# EAGLE design MDBT42Q_testboard (EAGLE 8.2.2)
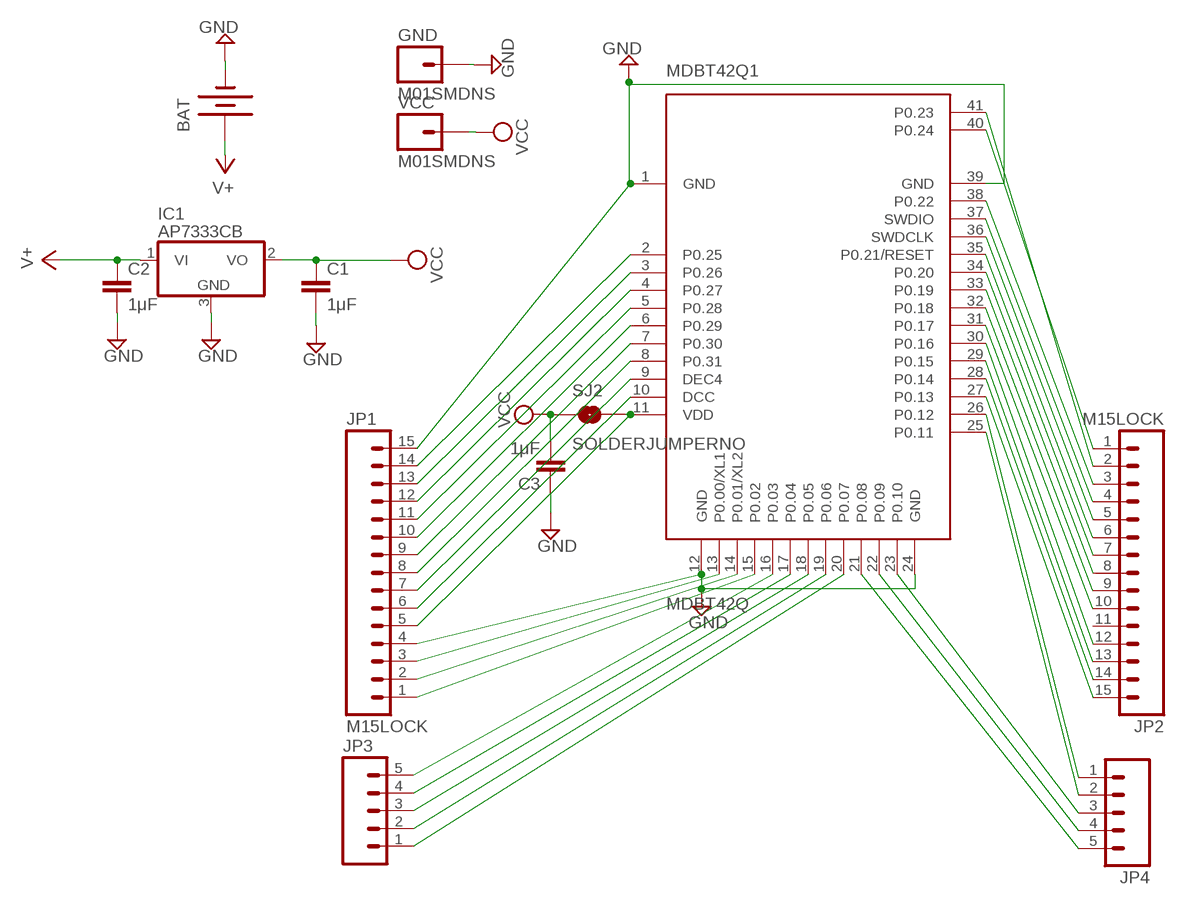
[diagram p0: schematic, sheet 1]

## Parts
BAT  BATTERYFOB  [BATTERY_20MM_PTH_COMPACT]
C1  1μF  CAP0603-CAP  [0603-CAP]
C2  1μF  CAP0603-CAP  [0603-CAP]
C3  1μF  CAP0603-CAP  [0603-CAP]
GND  M01SMDNS  [1X01NS]
IC1  AP7333CB  [SOT23]
JP1  M15LOCK  [1X15_LOCK]
JP2  M15LOCK  [1X15_LOCK]
JP3  M05LOCK  [1X05_LOCK]
JP4  M05LOCK  [1X05_LOCK]
MDBT42Q1  MDBT42Q  [MDBT42Q]
SJ2  SOLDERJUMPERNO  [SJ_2S-NO]
VCC  M01SMDNS  [1X01NS]

## Nets
GND: BAT.2(-) C1.2 C2.2 C3.1 GND.1 IC1.3(GND) JP1.4 JP1.15 MDBT42Q1.1(GND) MDBT42Q1.12(GND) MDBT42Q1.24(GND) MDBT42Q1.39(GND)
N$1: JP1.5 MDBT42Q1.11(VDD) SJ2.2
N$2: JP1.14 MDBT42Q1.2(P0.25)
N$3: JP1.13 MDBT42Q1.3(P0.26)
N$4: JP1.12 MDBT42Q1.4(P0.27)
N$5: JP1.11 MDBT42Q1.5(P0.28)
N$6: JP2.9 MDBT42Q1.32(P0.18)
N$7: JP1.10 MDBT42Q1.6(P0.29)
N$8: JP1.9 MDBT42Q1.7(P0.30)
N$9: JP1.8 MDBT42Q1.8(P0.31)
N$10: JP1.7 MDBT42Q1.9(DEC4)
N$11: JP1.6 MDBT42Q1.10(DCC)
N$12: JP1.3 MDBT42Q1.13(P0.00/XL1)
N$13: JP1.2 MDBT42Q1.14(P0.01/XL2)
N$14: JP1.1 MDBT42Q1.15(P0.02)
N$15: JP3.5 MDBT42Q1.16(P0.03)
N$16: JP3.4 MDBT42Q1.17(P0.04)
N$17: JP3.3 MDBT42Q1.18(P0.05)
N$18: JP3.2 MDBT42Q1.19(P0.06)
N$19: JP3.1 MDBT42Q1.20(P0.07)
N$20: JP4.5 MDBT42Q1.21(P0.08)
N$21: JP4.4 MDBT42Q1.22(P0.09)
N$22: JP4.3 MDBT42Q1.23(P0.10)
N$23: JP4.2 MDBT42Q1.25(P0.11)
N$24: JP4.1 MDBT42Q1.26(P0.12)
N$25: JP2.15 MDBT42Q1.27(P0.13)
N$26: JP2.14 MDBT42Q1.28(P0.14)
N$27: JP2.13 MDBT42Q1.29(P0.15)
N$28: JP2.12 MDBT42Q1.30(P0.16)
N$29: JP2.10 MDBT42Q1.31(P0.17)
N$30: JP2.8 MDBT42Q1.33(P0.19)
N$31: JP2.7 MDBT42Q1.34(P0.20)
N$32: JP2.6 MDBT42Q1.35(P0.21/RESET)
N$33: JP2.5 MDBT42Q1.36(SWDCLK)
N$34: JP2.4 MDBT42Q1.37(SWDIO)
N$35: JP2.3 MDBT42Q1.38(P0.22)
N$36: JP2.1 MDBT42Q1.40(P0.24)
N$37: JP2.2 MDBT42Q1.41(P0.23)
V+: BAT.1(+) C2.1 IC1.1(VI)
VCC: C1.1 C3.2 IC1.2(VO) SJ2.1 VCC.1
Unconnected: JP2.11

## Library data of the parts
BAT = SparkFun:BATTERY: Battery Holders Various common sizes : AA, AAA, 20mm coin cell and 12mm coin cell.
C1-C3 = SparkFun:CAP: Capacitor Standard 0603 ceramic capacitor, and 0.1" leaded capacitor.
GND VCC = SparkFun:M01: Header 1 Standard 1-pin 0.1" header. Use with straight break away headers (SKU : PRT-00116), right angle break away headers (PRT-00553), swiss pins (PRT-00743), machine pins (PRT-00117), and female headers (PRT-00115).
IC1 = linear:AP7333: 250 mA, 16V, Low Quiescent Current LDO Regulator Source: http://ww1.microchip.com/downloads/en/DeviceDoc/22049b.pdf
JP1 JP2 = SparkFun:M15: Header 15 Standard 15-pin 0.1" header. Use with straight break away headers (SKU : PRT-00116), right angle break away headers (PRT-00553), swiss pins (PRT-00743), machine pins (PRT-00117), and female headers (PRT-00115).
JP3 JP4 = SparkFun:M05: Header 5 Standard 5-pin 0.1" header. Use with straight break away headers (SKU : PRT-00116), right angle break away headers (PRT-00553), swiss pins (PRT-00743), machine pins (PRT-00117), and female headers (PRT-00115). Molex polarized connector foot print use with SKU : PRT-08230 with associated crimp pins and housings.
MDBT42Q1 = MDBT42Q_170329:MDBT42Q: Raytac Corporation MDBT42Q-512K, MDBT42Q-P512K Bluetooth Low Energy Module based on Noridc nRF52832 Source: Raytac datasheet
SJ2 = SparkFun:SOLDERJUMPER: Solder Jumper Standard SMD solder jumper. Used to automate production. Two varients : Normally Open and Normally Closed are the same, but have different paste layers. NC will have a large amount of paste and should jumper during reflow.

## Board
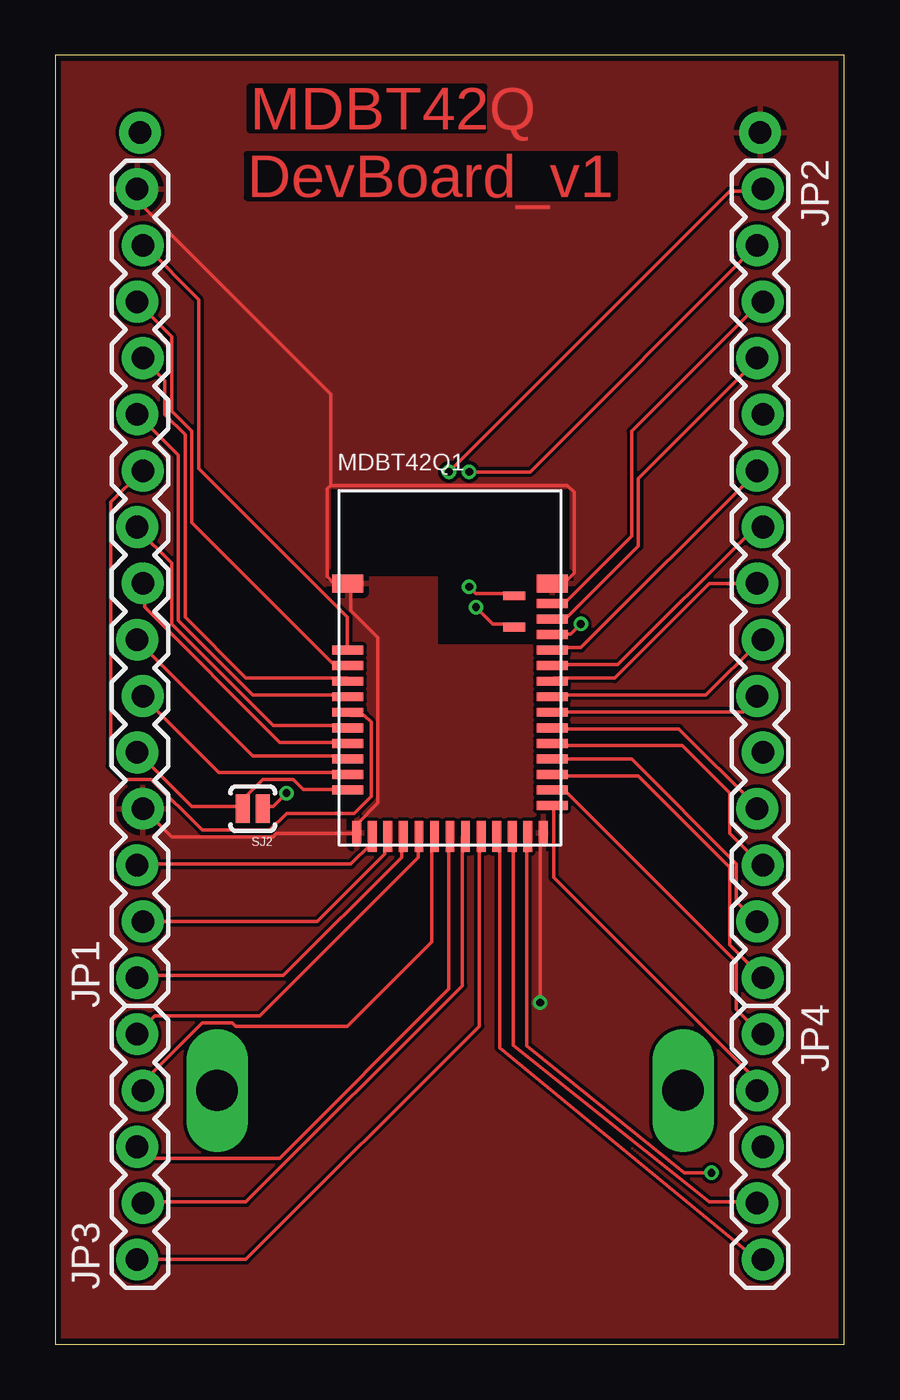
[diagram p1: board, top side]
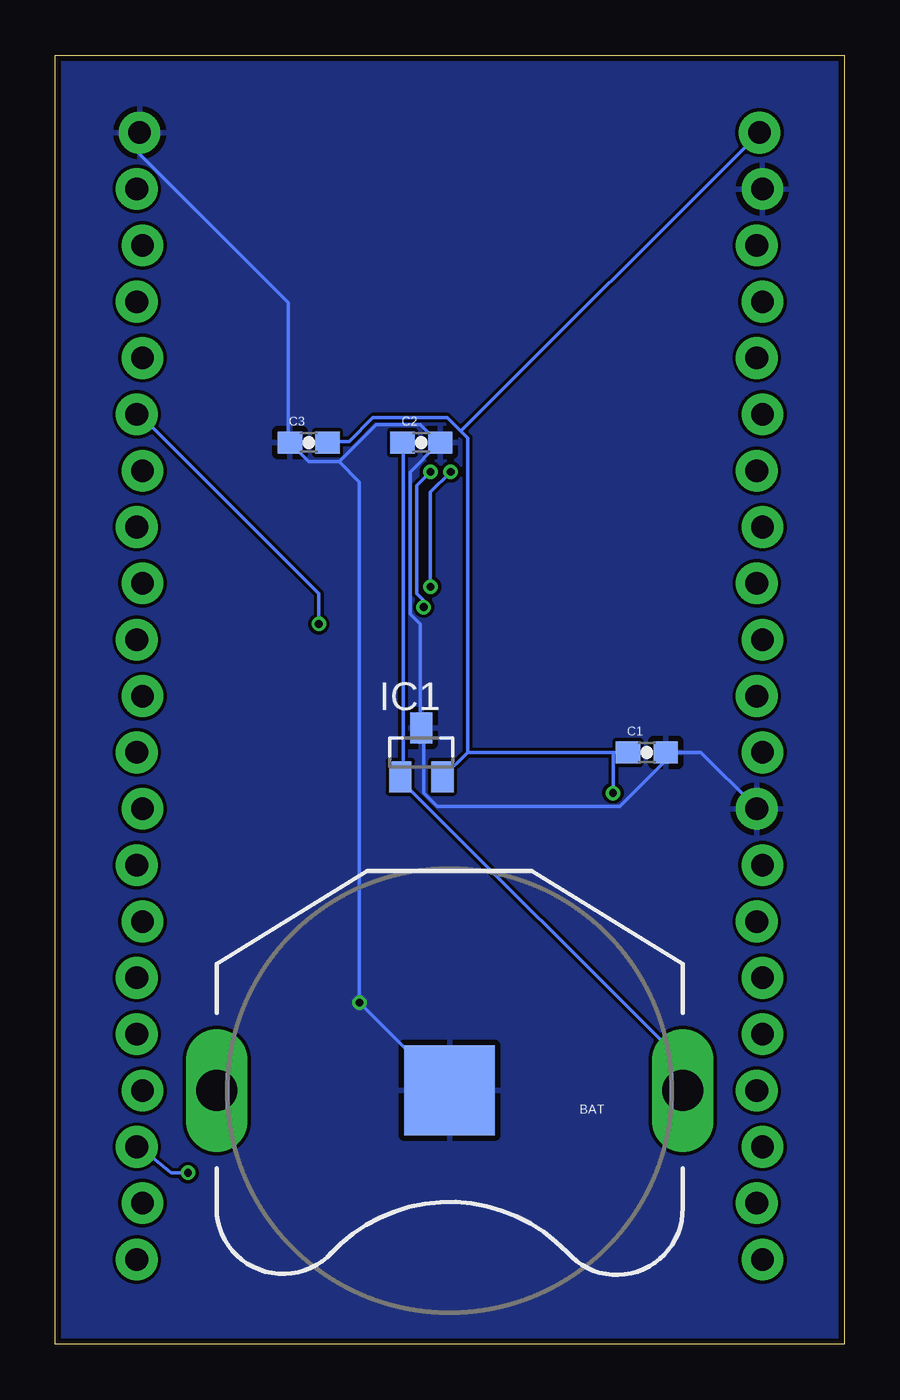
[diagram p2: board, bottom side, seen from below]

Size 35.54 x 58.09 mm. Coordinates in mm from the lower left corner, seen from the top.
Outline: 0,0 35.54,0 35.54,58.09 0,58.09 0,0
Copper layers (1*16): Top 0.035mm / dielectric 1.5mm / Bottom 0.035mm
Design rules "SeeedStudio_2layer_DRU_no_angle_20140221": minimum track width 6mil, minimum drill 12mil, track to track 6mil, track to pad 6mil, pad to pad 6mil, via to via 6mil, smd to smd 0mil, copper to edge 10mil, drill to drill 10mil, minimum pad ring 10mil, minimum via ring 6mil, stop-mask expansion 2mil, vias tented up to drill 100mil, thermal gap 10mil

### Footprints (pad centres in the part's own frame; a part is rotated, then mirrored left to right if it is on the bottom)
BATTERY_20MM_PTH_COMPACT = drill 1.854 long: 1 -10.5,0; 3 10.5,0 | smd 4.064 x 4.064: 2 0,0
0603-CAP = smd 1.1 x 1: 1 -0.85,0; 2 0.85,0
1X01NS = drill 1.016 pad 1.88: 1 0,0
SOT23 = smd 1 x 1.4: 1 -0.95,-1.1; 2 0.95,-1.1; 3 0,1.1
1X15_LOCK = drill 1.016 pad 1.88: 1 0,0.127; 2 2.54,-0.127; 3 5.08,0.127; 4 7.62,-0.127; 5 10.16,0.127; 6 12.7,-0.127; 7 15.24,0.127; 8 17.78,-0.127; 9 20.32,0.127; 10 22.86,-0.127; 11 25.4,0.127; 12 27.94,-0.127; 13 30.48,0.127; 14 33.02,-0.127; 15 35.56,0.127
1X05_LOCK = drill 1.016 pad 1.88: 1 0,0.127; 2 2.54,-0.127; 3 5.08,0.127; 4 7.62,-0.127; 5 10.16,0.127
MDBT42Q = smd 1.4 x 0.8: 1 -4.6,3.8; 39 4.6,3.8 | smd 1.4 x 0.4: 2 -4.6,0.8; 3 -4.6,0.1; 4 -4.6,-0.6; 5 -4.6,-1.3; 6 -4.6,-2; 7 -4.6,-2.7; 8 -4.6,-3.4; 9 -4.6,-4.1; 10 -4.6,-4.8; 11 -4.6,-5.5; 25 4.6,-6.2; 26 4.6,-5.5; 27 4.6,-4.8; 28 4.6,-4.1; 29 4.6,-3.4; 30 4.6,-2.7; 31 4.6,-2; 32 4.6,-1.3; 33 4.6,-0.6; 34 4.6,0.1; 35 4.6,0.8; 36 4.6,1.5; 37 4.6,2.2; 38 4.6,2.9 | smd 0.4 x 1.1: 12 -4.2,-7.45; 24 4.2,-7.45 | smd 0.4 x 1.4: 13 -3.5,-7.6; 14 -2.8,-7.6; 15 -2.1,-7.6; 16 -1.4,-7.6; 17 -0.7,-7.6; 18 0,-7.6; 19 0.7,-7.6; 20 1.4,-7.6; 21 2.1,-7.6; 22 2.8,-7.6; 23 3.5,-7.6 | smd 1 x 0.4: 40 2.9,3.25; 41 2.9,1.85
SJ_2S-NO = smd 0.635 x 1.27: 1 -0.45,0; 2 0.45,0

### Placement (x,y rotation side)
BAT  17.78,11.43 180 bottom
C1  8.89,26.67 0 bottom
C2  19.05,40.64 0 bottom
C3  24.13,40.64 0 bottom
GND  31.75,54.61 0 top
IC1  19.05,26.67 0 bottom
JP1  3.81,16.51 90 top
JP2  31.75,52.07 270 top
JP3  3.81,3.81 90 top
JP4  31.75,13.97 270 top
MDBT42Q1  17.78,30.48 0 top
SJ2  8.89,24.13 180 top
VCC  3.81,54.61 0 top

### Tracks (layer width: path | path; a pad name or v marks a point on that pad's centre or on a via)
GND  (via drill 0.35)
  Top 0.152: JP1.4 4.01,24.08 5.23,22.86 9.8,22.86 9.96,23.01 13.46,23.01 MDBT42Q1.12 13.61,23.16 13.61,23.47 14.53,24.38 14.53,31.85 13.31,33.07 13.31,34.14 MDBT42Q1.1 13.16,34.29 12.55,34.29 12.24,34.59 12.24,38.56 12.39,38.71 | 12.39,38.71 23.06,38.71 23.37,38.41 23.37,34.75 22.91,34.29 22.45,34.29 MDBT42Q1.39 | 12.39,38.71 12.39,42.82 3.71,51.51 3.71,51.97 JP1.15 | v21.84,15.39 21.84,23.01 MDBT42Q1.24
  Bottom 0.152: JP1.4 4.01,24.23 6.45,26.67 C1.2 8.13,26.67 8.13,26.21 10.11,24.23 18.34,24.23 18.95,24.84 18.95,27.74 IC1.3 19.1,27.89 19.1,32.46 19.56,32.92 19.56,39.32 18.34,40.54 C2.2 18.34,40.69 19.1,41.45 21.08,41.45 22.76,39.78 | BAT.2 17.88,11.43 v21.84,15.39 21.84,38.86 22.76,39.78 | 22.76,39.78 24.13,39.78 24.89,40.54 C3.1 25.04,40.69 25.04,46.94 31.75,53.65 GND.1
  pour Top: 0.13,58.04 0.13,0.25 -0.13,0 35.56,0 35.56,57.78 35.69,57.91 0.25,57.91
  pour Bottom: -0.13,58.04 -0.13,-0.25 35.56,-0.25 35.81,0 35.81,58.17 35.69,58.29 0.13,58.29
N$1
  Top 0.152: JP1.5 3.71,26.67 6.15,24.23 8.43,24.23 SJ2.2 8.59,24.23 8.59,24.69 9.35,25.45 10.72,25.45 11.18,24.99 13.16,24.99 MDBT42Q1.11
N$2
  Top 0.152: MDBT42Q1.2 13.16,31.39 13.16,32.77 6.45,39.47 6.45,47.09 4.01,49.53 JP1.14
N$3
  Top 0.152: MDBT42Q1.3 13.16,30.63 12.55,30.63 6.15,37.03 6.15,41.15 5.23,42.06 5.23,45.41 3.71,46.94 JP1.13
N$4
  Top 0.152: MDBT42Q1.4 13.16,30.02 8.59,30.02 5.84,32.77 5.84,41 4.93,41.91 4.93,43.43 4.01,44.35 JP1.12
N$5
  Top 0.152: MDBT42Q1.5 13.16,29.26 8.89,29.26 5.54,32.61 5.54,40.08 3.71,41.91 JP1.11
N$6
  Top 0.152: MDBT42Q1.32 22.45,29.26 29.31,29.26 31.75,31.7 JP2.9
N$7
  Top 0.152: MDBT42Q1.6 13.31,28.35 13.92,28.35 14.22,28.04 14.22,24.69 13.46,23.93 10.41,23.93 9.65,23.16 6.6,23.16 4.32,25.45 3.1,25.45 2.49,26.06 2.49,37.95 3.86,39.32 JP1.10
N$8
  Top 0.152: MDBT42Q1.7 13.16,27.89 9.8,27.89 5.23,32.46 5.23,35.2 3.71,36.73 JP1.9
N$9
  Top 0.152: MDBT42Q1.8 13.16,27.13 10.11,27.13 4.01,33.22 4.01,34.29 JP1.8
N$10
  Top 0.152: MDBT42Q1.9 13.16,26.52 8.89,26.52 3.71,31.7 JP1.7
N$11
  Top 0.152: MDBT42Q1.10 13.16,25.76 7.37,25.76 4.01,29.11 JP1.6
N$12
  Top 0.152: MDBT42Q1.13 14.22,22.86 14.22,22.55 13.31,21.64 3.71,21.64 JP1.3
N$13
  Top 0.152: JP1.2 11.79,19.05 14.83,22.1 14.83,22.86 MDBT42Q1.14
N$14
  Top 0.152: MDBT42Q1.15 15.6,22.86 15.6,21.95 10.26,16.61 3.71,16.61 JP1.1
N$15
  Top 0.152: MDBT42Q1.16 16.36,22.86 16.36,21.95 9.2,14.78 4.47,14.78 3.71,14.02 JP3.5
N$16
  Top 0.152: MDBT42Q1.17 16.97,22.86 16.97,18.14 13.16,14.33 8.13,14.33 7.98,14.48 6.6,14.48 4.01,11.89 4.01,11.43 JP3.4
N$17
  Top 0.152: MDBT42Q1.18 17.73,22.86 17.73,16 10.11,8.38 4.17,8.38 3.71,8.84 JP3.3
N$18
  Top 0.152: MDBT42Q1.19 18.34,22.86 18.34,16.15 8.59,6.4 4.01,6.4 JP3.2
N$19
  Top 0.152: JP3.1 8.59,3.81 19.1,14.33 19.1,22.86 MDBT42Q1.20
N$20
  Top 0.152: JP4.5 31.6,3.81 20.02,13.36 20.02,22.86 MDBT42Q1.21
N$21
  Top 0.152: MDBT42Q1.22 20.62,22.86 20.62,13.46 29.46,6.4 31.6,6.4 JP4.4
N$22  (via drill 0.35)
  Top 0.152: v29.57,7.72 28.35,7.72 21.23,13.44 21.23,22.86 MDBT42Q1.23
  Bottom 0.152: v29.57,7.72 30.33,7.72 30.68,8 31.29,8.51 31.75,8.84 JP4.3
N$23
  Top 0.152: MDBT42Q1.25 22.45,24.23 22.45,21.03 31.6,11.89 31.6,11.43 JP4.2
N$24
  Top 0.152: MDBT42Q1.26 22.45,24.84 23.06,24.84 30.68,17.22 30.68,15.09 31.75,14.02 JP4.1
N$25
  Top 0.152: MDBT42Q1.27 22.45,25.6 26.26,25.6 30.38,21.49 30.38,17.98 31.75,16.61 JP2.15
N$26
  Top 0.152: MDBT42Q1.28 22.45,26.36 25.96,26.36 30.68,21.64 30.68,19.96 31.6,19.05 JP2.14
N$27
  Top 0.152: MDBT42Q1.29 22.45,26.98 28.25,26.98 30.38,24.84 30.38,23.01 31.75,21.64 JP2.13
N$28
  Top 0.152: MDBT42Q1.30 22.45,27.74 28.09,27.74 31.6,24.23 JP2.12
N$29
  Top 0.152: MDBT42Q1.31 22.45,28.5 30.99,28.5 31.6,29.11 JP2.10
N$30
  Top 0.152: JP2.8 29.46,34.29 25.2,30.02 22.45,30.02 MDBT42Q1.33
N$31
  Top 0.152: MDBT42Q1.34 22.45,30.63 25.35,30.63 31.45,36.73 31.75,36.73 JP2.7
N$32
  Top 0.152: MDBT42Q1.35 22.45,31.39 23.67,31.39 31.6,39.32 JP2.6
N$33  (via drill 0.35)
  Top 0.152: v23.67,32.46 23.22,32 22.45,32 MDBT42Q1.36
  Bottom 0.152: v23.67,32.46 23.67,33.83 31.75,41.91 JP2.5
N$34
  Top 0.152: MDBT42Q1.37 22.45,32.77 23.06,32.77 26.26,35.97 26.26,39.01 31.6,44.35 JP2.4
N$35
  Top 0.152: MDBT42Q1.38 22.45,33.53 23.06,33.53 25.96,36.42 25.96,41.15 31.75,46.94 JP2.3
N$36  (via drill 0.35)
  Top 0.152: v18.64,34.14 18.95,33.83 20.62,33.83 MDBT42Q1.40 | v17.73,39.32 30.38,51.97 31.75,51.97 JP2.1
  Bottom 0.152: v18.64,34.14 18.64,38.41 v17.73,39.32
N$37  (via drill 0.35)
  Top 0.152: v18.95,33.22 19.71,32.46 20.62,32.46 MDBT42Q1.41 | v18.64,39.32 21.39,39.32 31.6,49.53 JP2.2
  Bottom 0.152: v18.95,33.22 18.95,33.53 19.25,33.83 19.25,38.71 v18.64,39.32
V+
  Bottom 0.152: C2.1 19.86,40.54 19.86,25.6 IC1.1 20.02,25.45 7.37,12.8 7.37,11.43 BAT.1
VCC  (via drill 0.35)
  Top 0.152: v10.41,24.84 9.8,24.23 9.35,24.23 SJ2.1
  Bottom 0.152: 16.97,26.67 10.41,26.67 | 10.41,26.67 C1.1 | 16.97,26.67 18.03,25.6 IC1.2 | 17.27,41.15 16.97,40.84 16.97,26.67 | 17.27,41.15 17.88,41.76 21.23,41.76 22.3,40.69 23.22,40.69 C3.2 | 10.41,26.67 v10.41,24.84 | 17.27,41.15 VCC.1

### Text on the board
Top: MDBT42Q | DevBoard_v1